# Altium schematic sheet M5TeslaCoilTuner.SchDoc
size 190 x 120 mm
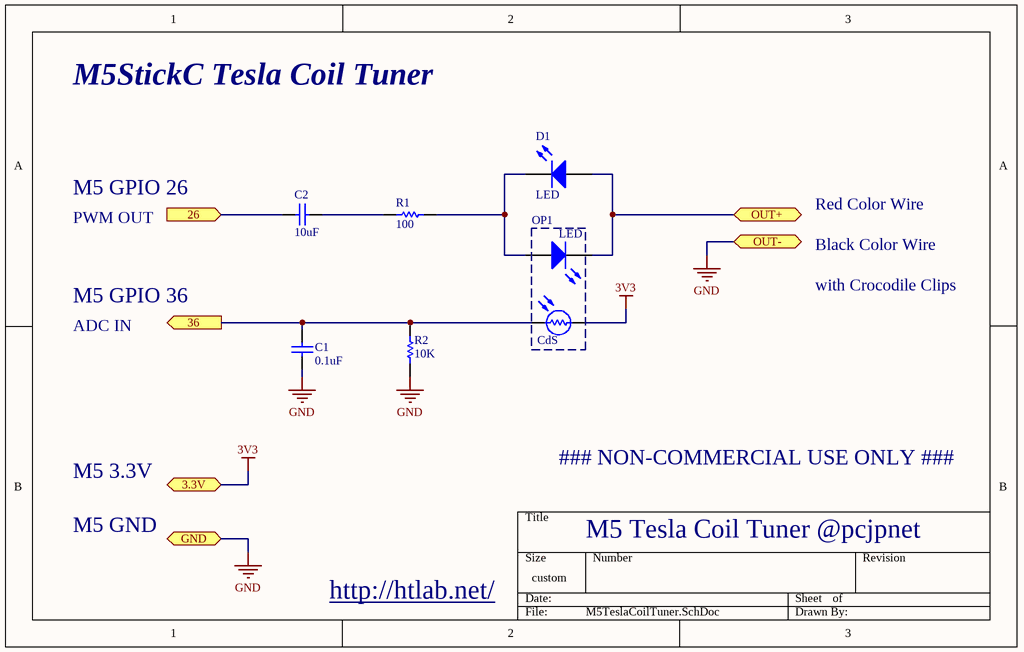
[diagram p0: M5TeslaCoilTuner.SchDoc]

## Parts
C1  0.1uF  [RAD-0.3]
C2  10uF  [RAD-0.3]
D1  LED  [LED-1]
OP1  LED  [LED-1]
OP2  CdS  [AXIAL-0.3]
R1  100  [AXIAL-0.3]
R2  10K  [AXIAL-0.3]

## Ports
3.3V, 26 (in), 36 (out), GND, OUT+, OUT-

## Nets
3V3: OP2.2 ; port 3.3V
GND: C1.1 R2.1 ; port GND, port OUT-
26: C2.1 ; port 26
36: C1.2 OP2.1 R2.2 ; port 36
OUT+: D1.1(A) OP1.2(K) ; port OUT+
NetC2_2: C2.2 R1.1
NetD1_2: D1.2(K) OP1.1(A) R1.2

## Notes on the sheet
- M5StickC Tesla Coil Tuner
- M5 GPIO 26
- PWM OUT
- Red Color Wire
- Black Color Wire
- M5 GPIO 36
- ADC IN
- with Crocodile Clips
- ### NON-COMMERCIAL USE ONLY ###
- M5 3.3V
- M5 GND
- M5 Tesla Coil Tuner @pcjpnet
- http://htlab.net/

## Library data of the parts
C1 C2 = Cap: Capacitor; Value: 100pF; Published: 8-Jun-2000; LatestRevisionDate: 17-Jul-2002; LatestRevisionNote: Re-released for DXP Platform.; PackageReference: RAD-0.3; Publisher: Altium Limited; PackageDescription: Radial Cap, Thru-Hole; 2 Leads; 0.3 in Pin Spacing
D1 OP1 = LED1: Typical RED GaAs LED; Published: 8-Jun-2000; LatestRevisionDate: 08-Jul-2005; LatestRevisionNote: Mech Layer 1 removed.; PackageReference: LED-1; Publisher: Altium Limited; PackageDescription: LED; 2 Leads
OP2 = CdS: Resistor; Value: 1K; Published: 8-Jun-2000; LatestRevisionDate: 17-Jul-2002; LatestRevisionNote: Re-released for DXP Platform.; PackageReference: AXIAL-0.3; Publisher: Altium Limited; PackageDescription: Axial Device, Thru-Hole; 2 Leads; 0.3 in Pin Spacing
R1 R2 = Res1: Resistor; Value: 1K; Published: 8-Jun-2000; LatestRevisionDate: 17-Jul-2002; LatestRevisionNote: Re-released for DXP Platform.; PackageReference: AXIAL-0.3; Publisher: Altium Limited; PackageDescription: Axial Device, Thru-Hole; 2 Leads; 0.3 in Pin Spacing